# EAGLE design TREMONE (EAGLE 9.2.2)
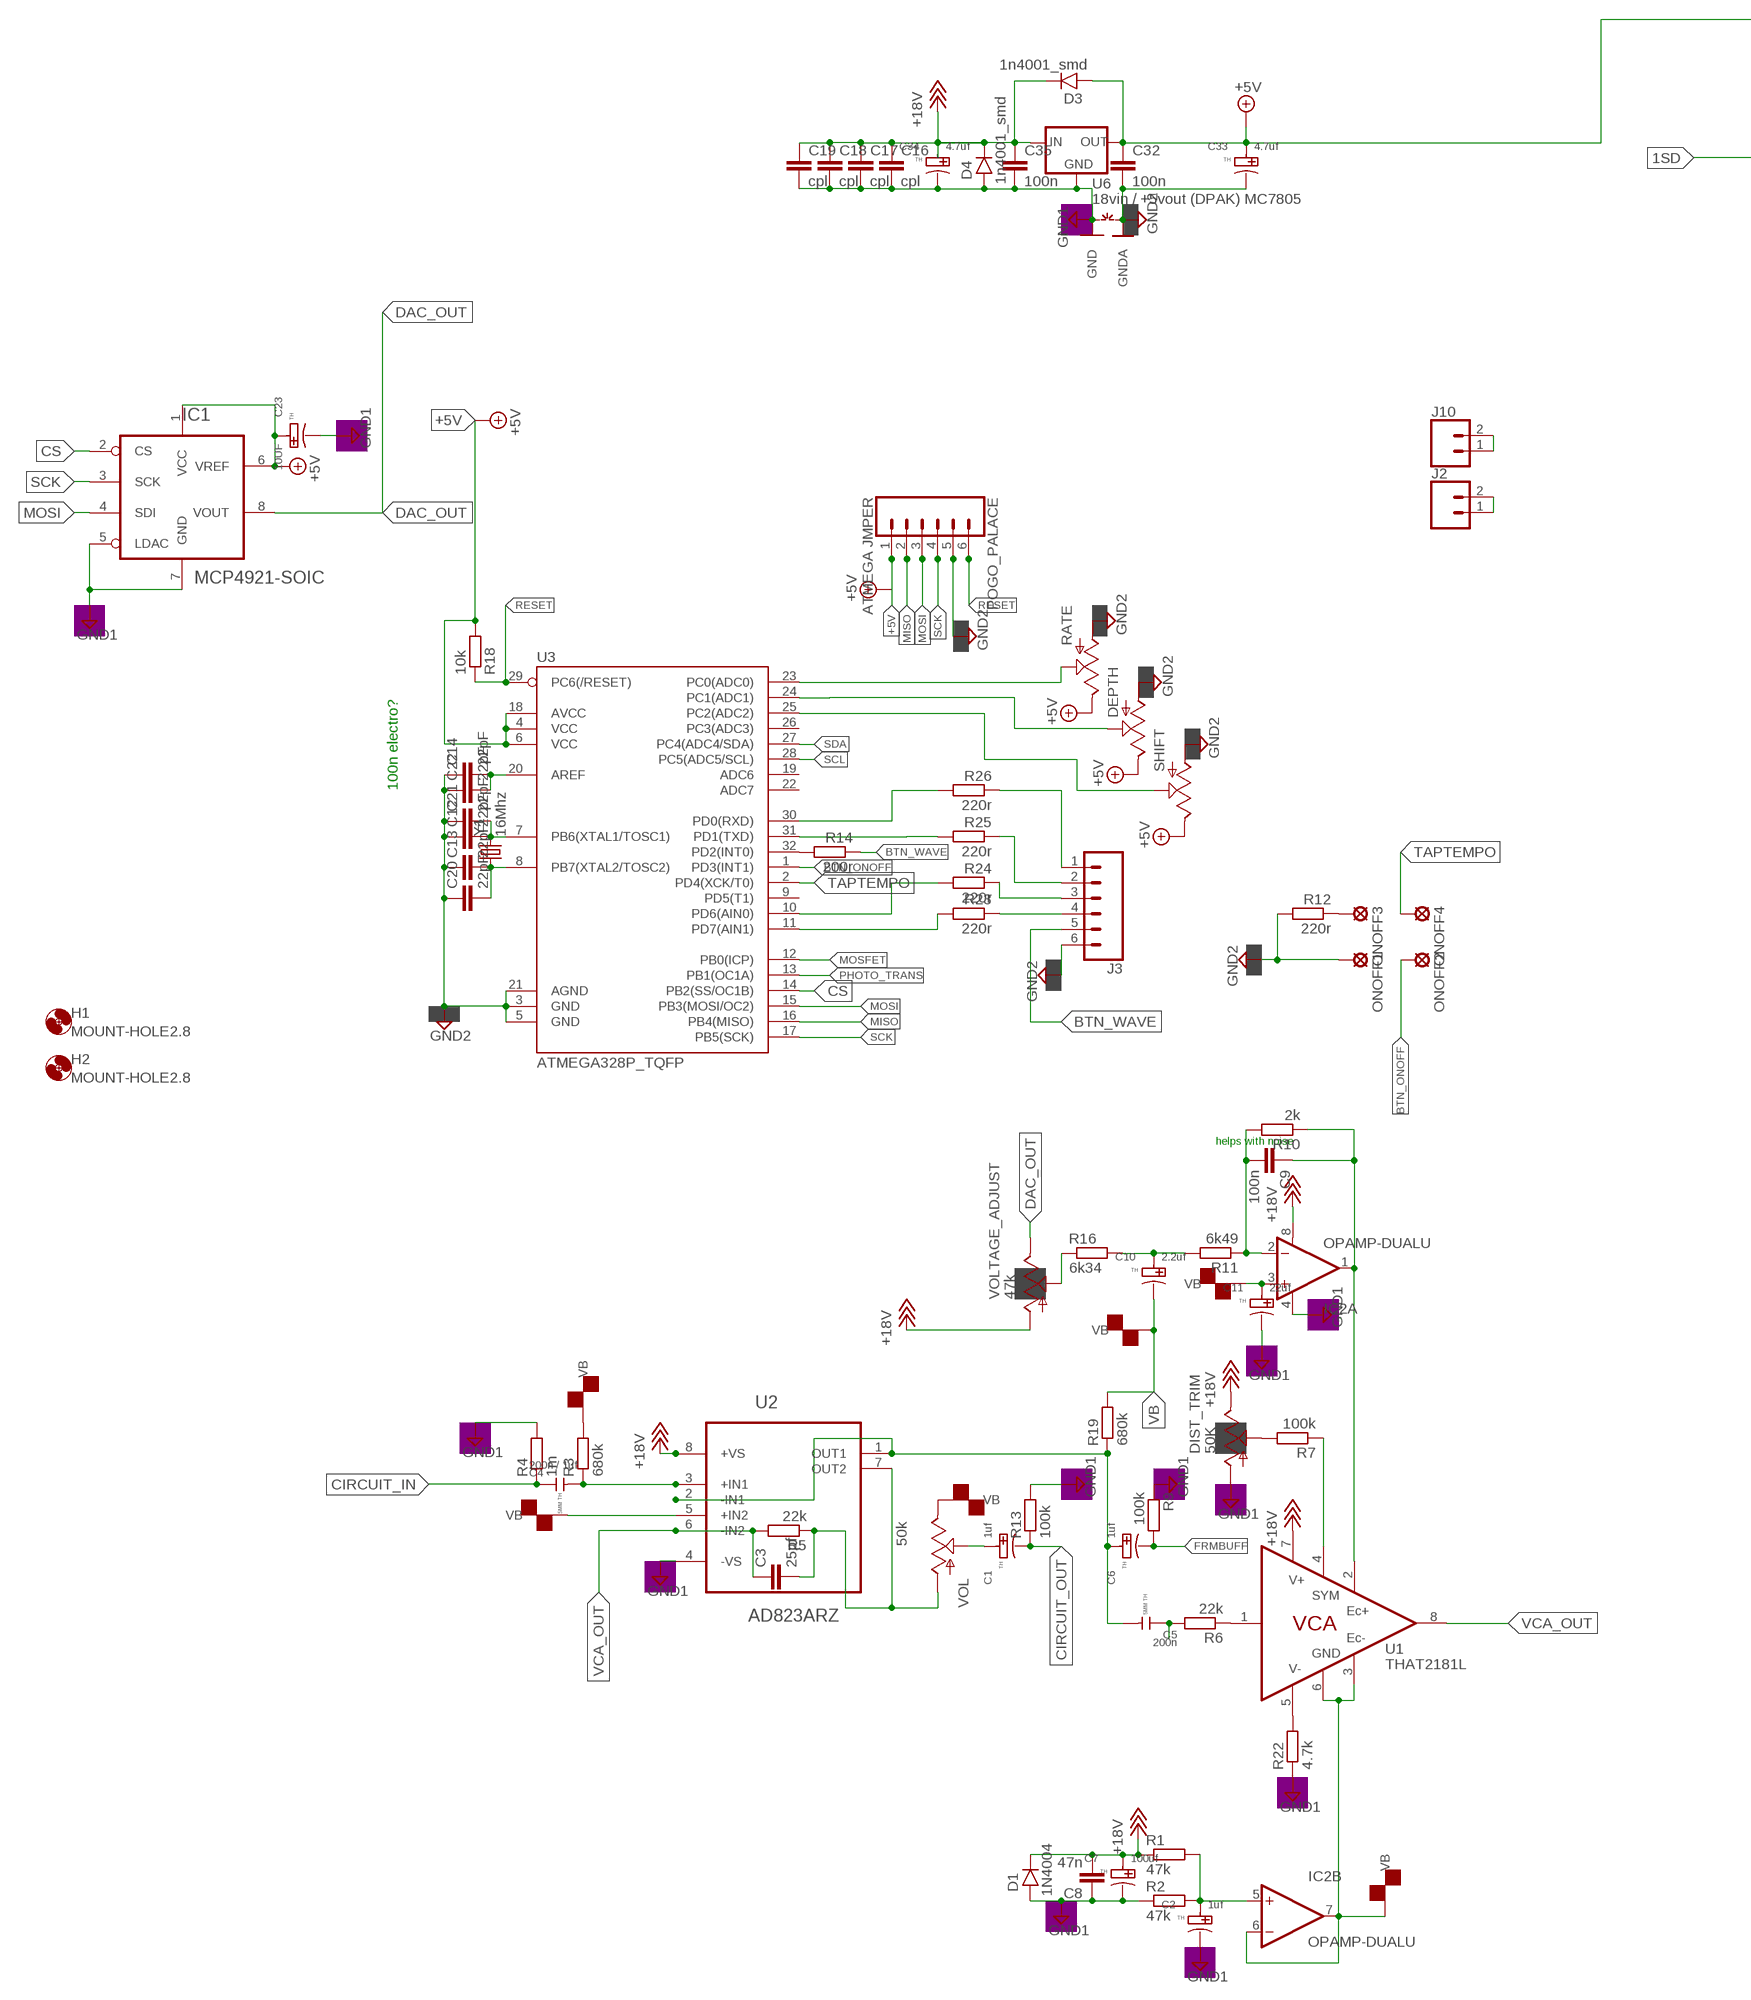
[diagram p0: schematic, sheet 1, part 1 of 2]
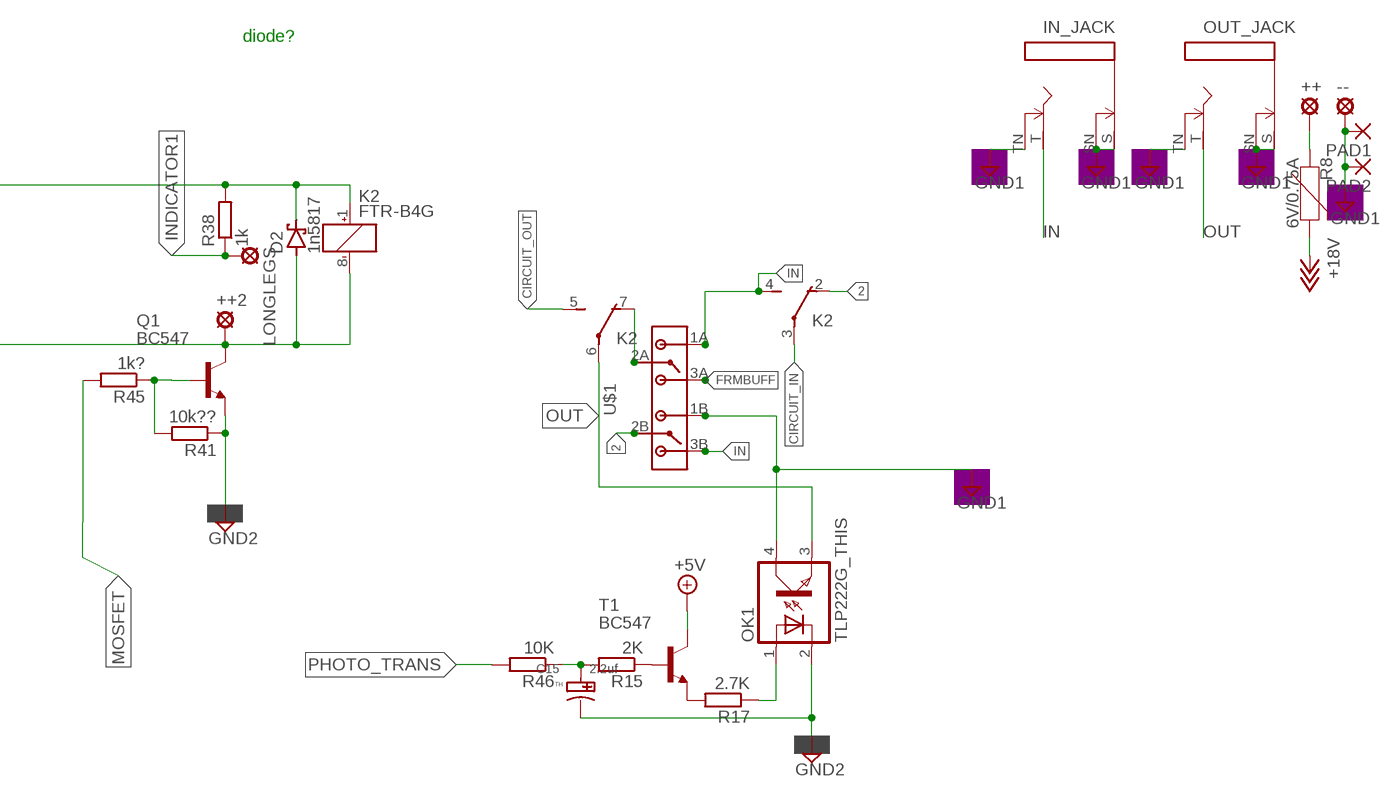
[diagram p1: schematic, sheet 1, part 2 of 2]

## Parts
++  LSP10  [LSP10]
++2  LSP10  [LSP10]
--  LSP10  [LSP10]
C1  1uf  THRU-HOLE-POLARIZED  [PC-D5.3MM]
C2  1uf  THRU-HOLE-POLARIZED  [PC-D5.3MM]
C3  25pf  C-EUC1206  [C1206]
C4  200n / 1uf  THRU_HOLE_5MM_SPACING  [CERAMIC-5MM]
C5  200n  THRU_HOLE_5MM_SPACING  [CERAMIC-5MM]
C6  1uf  THRU-HOLE-POLARIZED  [PC-D5.3MM]
C7  100uf  THRU-HOLE-POLARIZED  [PC-D5.3MM]
C8  47n  C-EUC1206  [C1206]
C9  100n  C-EUC1206  [C1206]
C10  2.2uf  THRU-HOLE-POLARIZED  [PC-D5.3MM]
C11  22uf  THRU-HOLE-POLARIZED  [PC-D5.3MM]
C12  22pF  22PF-0603-50V-5%  [0603]
C13  22pF  22PF-0603-50V-5%  [0603]
C14  22pF  22PF-PTH-2.54MM-200V-5%  [CAP-PTH-2.54]
C15  2.2uf  THRU-HOLE-POLARIZED  [PC-D5.3MM]
C16  cpl  C-EUC1206  [C1206]
C17  cpl  C-EUC1206  [C1206]
C18  cpl  C-EUC1206  [C1206]
C19  cpl  C-EUC1206  [C1206]
C20  22pF  22PF-PTH-2.54MM-200V-5%  [CAP-PTH-2.54]
C21  22pF  22PF-PTH-2.54MM-200V-5%  [CAP-PTH-2.54]
C22  22pF  22PF-0603-50V-5%  [0603]
C23  10UF  THRU-HOLE-POLARIZED  [PC-D5.3MM]
C32  100n  C-EUC1206  [C1206]
C33  4.7uf  THRU-HOLE-POLARIZED  [PC-D5.3MM]
C34  4.7uf  THRU-HOLE-POLARIZED  [PC-D5.3MM]
C35  100n  C-EUC1206  [C1206]
D1  1N4004  1N400X.1  [DO41-1]
D2  1n5817  SCHOTTKY-DIODESMD  [SMB]
D3  1n4001_smd  1N400X.1  [DO41-1]
D4  1n4001_smd  1N400X.1  [DO41-1]
DEPTH  POT  [ALPS_POT]
DIST_TRIM  50K  TRIM_US-3223G  [3223G]
H1  MOUNT-HOLE2.8  [2,8]
H2  MOUNT-HOLE2.8  [2,8]
IC1  MCP4921-SOIC  [SOIC-8]
IC2  OPAMP-DUALU  [SO08]
IN_JACK  MMMONNNNOHOLES  [MONONOHOLES]
J2  CONN_02PTH3  [1X02_LONGPADS]
J3  CONN_06NO_SILK_FEMALE_PTH  [1X06_NO_SILK]
J10  CONN_02PTH3  [1X02_LONGPADS]
K2  FTR-B4G  [FTR-B4G]
LONGLEGS  LSP10  [LSP10]
OK1  TLP222G_THIS  [DIL04]
ONOFF1  LSP10  [LSP10]
ONOFF2  LSP10  [LSP10]
ONOFF3  LSP10  [LSP10]
ONOFF4  LSP10  [LSP10]
OUT_JACK  MMMONNNNOHOLES  [MONONOHOLES]
PAD1  SMD5  [SMD2,54-5,08]
PAD2  SMD5  [SMD2,54-5,08]
POGO_PALACE  ATMEGA JMPER  CONN_06LONGPADS  [1X06_LONGPADS]
Q1  BC547  [TO92]
R1  47k  R-EU_M1206  [M1206]
R2  47k  R-EU_M1206  [M1206]
R3  680k  R-EU_M1206  [M1206]
R4  1m  R-EU_M1206  [M1206]
R5  22k  R-EU_M1206  [M1206]
R6  22k  R-EU_M1206  [M1206]
R7  100k  R-EU_M1206  [M1206]
R8  6V/0.75A  PPTC_THREE-QUARTER-AMP  [1206]
R9  100k  R-EU_M1206  [M1206]
R10  2k  R-EU_M1206  [M1206]
R11  6k49  R-EU_M1206  [M1206]
R12  220r  R-EU_M1206  [M1206]
R13  100k  R-EU_M1206  [M1206]
R14  200r  R-EU_M1206  [M1206]
R15  2K  R-EU_M1206  [M1206]
R16  6k34  R-EU_M1206  [M1206]
R17  2.7K  R-EU_M1206  [M1206]
R18  10k  R-EU_M1206  [M1206]
R19  680k  R-EU_M1206  [M1206]
R22  4.7k  R-EU_M1206  [M1206]
R23  220r  R-EU_M1206  [M1206]
R24  220r  R-EU_M1206  [M1206]
R25  220r  R-EU_M1206  [M1206]
R26  220r  R-EU_M1206  [M1206]
R38  1k  R-EU_M1206  [M1206]
R41  10k??  R-EU_M1206  [M1206]
R45  1k?  R-EU_M1206  [M1206]
R46  10K  R-EU_M1206  [M1206]
RATE  POT  [ALPS_POT]
SHIFT  POT  [ALPS_POT]
T1  BC547  [TO92]
U1  THAT2181L  [SIP8]
U2  AD823ARZ  [SOIC127P600X175-8N]
U3  ATMEGA328P_TQFP  [TQFP32-08]
U6  18vin / +5vout (DPAK) MC7805  V_REG_78XX7812  [TO-252]
U$1  BYSWITCH  [BUFF/TRBYPASS]
VOL  50k  POT  [ALPS_POT]
VOLTAGE_ADJUST  47k  TRIM_US-3223G  [3223G]
Y1  16Mhz  CRYSTALHC49US  [HC49US]
~NUDEV~1  GND-GNDA1,27MM  [GND-GNDA-1,27MM]

## Nets
1SD: ++2.MP D2.A K2.8(K:-) Q1.3(C)
2: K2.2(-1:O) U$1.2B
+5V: C23.+ C32.1 C33.+ D2.C D3.A DEPTH.P$1(E) IC1.1(VCC) IC1.6(VREF) K2.1(K:+) POGO_PALACE.1 R18.2 R38.2 RATE.P$1(E) SHIFT.P$1(E) T1.3(C) U3.4(VCC) U3.6(VCC) U3.18(AVCC) U6.2(OUT)
+18V: C7.+ C8.2 C16.1 C17.1 C18.1 C19.1 C34.+ C35.1 D1.C D3.C D4.C DIST_TRIM.3(E) IC2.8(A:V+) R1.1 R8.2 U1.7(V+) U2.8(+VS) U6.1(IN) VOLTAGE_ADJUST.1(A)
BTN_ONOFF: ONOFF2.MP U3.1(PD3(INT1))
BTN_WAVE: J3.5 R14.1
CIRCUIT_IN: C4.1 K2.3(-1:P) R4.1
CIRCUIT_OUT: C1.- K2.5(-2:S) R13.1
CS: IC1.2(CS) U3.14(PB2(SS/OC1B))
DAC_OUT: IC1.8(VOUT) VOLTAGE_ADJUST.3(E)
FRMBUFF: C6.- R9.2 U$1.3A
GND1: --.MP C2.- C7.- C8.1 C11.- C16.2 C17.2 C18.2 C19.2 C23.- C34.- C35.2 D1.A D4.A DIST_TRIM.1(A) IC1.5(LDAC) IC1.7(GND) IC2.4(A:V-) IN_JACK.S IN_JACK.SN IN_JACK.TN OK1.4(COL) OUT_JACK.S OUT_JACK.SN OUT_JACK.TN PAD1.1(P) PAD2.1(P) R2.1 R4.2 R9.1 R13.2 R22.1 U2.4(-VS) U6.3(GND) U$1.1B ~NUDEV~1.GND
GND2: C12.1 C13.1 C14.1 C15.- C20.1 C21.1 C22.1 C32.2 C33.- DEPTH.P$3(A) J3.6 OK1.2(C) ONOFF1.MP POGO_PALACE.5 Q1.1(E) R12.2 R41.1 RATE.P$3(A) SHIFT.P$3(A) U3.3(GND) U3.5(GND) U3.21(AGND) ~NUDEV~1.GNDA
IN: IN_JACK.T K2.4(-1:S) U$1.1A U$1.3B
INDICATOR1: LONGLEGS.MP R38.1
MISO: POGO_PALACE.2 U3.16(PB4(MISO))
MOSFET: R45.2 U3.12(PB0(ICP))
MOSI: IC1.4(SDI) POGO_PALACE.3 U3.15(PB3(MOSI/OC2))
N$1: C4.2 R3.1 U2.3(+IN1)
N$2: C2.+ IC2.5(B:+IN) R1.2 R2.2
N$3: ONOFF3.MP R12.1
N$4: R16.1 VOLTAGE_ADJUST.2(S)
N$5: C3.2 R5.1 U2.7(OUT2) VOL.P$3(A)
N$6: C5.2 C6.+ R19.1 U2.1(OUT1) U2.2(-IN1)
N$7: C5.1 R6.2
N$8: R6.1 U1.1(IN)
N$9: C1.+ VOL.P$2(S)
N$10: J2.1 J2.2
N$11: R7.1 U1.4(SYM)
N$12: DIST_TRIM.2(S) R7.2
N$13: C13.2 C20.2 U3.8(PB7(XTAL2/TOSC2)) Y1.1
N$14: C9.2 IC2.2(A:-IN) R10.2 R11.1
N$15: C12.2 C21.2 U3.7(PB6(XTAL1/TOSC1)) Y1.2
N$16: C14.2 C22.2 U3.20(AREF)
N$17: J3.4 R23.1
N$18: J3.3 R24.1
N$19: J3.2 R25.1
N$20: J10.1 J10.2
N$21: R22.2 U1.5(V-)
N$22: J3.1 R26.1
N$23: R26.2 U3.30(PD0(RXD))
N$24: R25.2 U3.31(PD1(TXD))
N$25: R24.2 U3.10(PD6(AIN0))
N$26: R23.2 U3.11(PD7(AIN1))
N$27: RATE.P$2(S) U3.23(PC0(ADC0))
N$28: DEPTH.P$2(S) U3.24(PC1(ADC1))
N$29: SHIFT.P$2(S) U3.25(PC2(ADC2))
N$30: R14.2 U3.32(PD2(INT0))
N$39: C15.+ R15.2 R46.1
N$40: R15.1 T1.2(B)
N$41: ++.MP R8.1
N$42: C9.1 IC2.1(A:OUT) R10.1 U1.2(EC+)
N$43: R17.2 T1.1(E)
N$44: OK1.1(A) R17.1
N$59: K2.7(-2:O) U$1.2A
N$84: Q1.2(B) R41.2 R45.1
OUT: K2.6(-2:P) OK1.3(EMIT) OUT_JACK.T
PHOTO_TRANS: R46.2 U3.13(PB1(OC1A))
R: C10.+ R11.2 R16.2
RESET: POGO_PALACE.6 R18.1 U3.29(PC6(/RESET))
SCK: IC1.3(SCK) POGO_PALACE.4 U3.17(PB5(SCK))
SCL: U3.28(PC5(ADC5/SCL))
SDA: U3.27(PC4(ADC4/SDA))
TAPTEMPO: ONOFF4.MP U3.2(PD4(XCK/T0))
VB: C10.- C11.+ IC2.3(A:+IN) IC2.6(B:-IN) IC2.7(B:OUT) R3.2 R19.2 U1.3(EC-) U1.6(GND) U2.5(+IN2) VOL.P$1(E)
VCA_OUT: C3.1 R5.2 U1.8(OUT) U2.6(-IN2)
Unconnected: U3.9(PD5(T1)) U3.19(ADC6) U3.22(ADC7) U3.26(PC3(ADC3))

## Notes on the sheet
- diode?
- 100n electro?
- helps with noise

## Library data of the parts
++ ++2 -- LONGLEGS ONOFF1-ONOFF4 = solpad:LSP10: SOLDER PAD drill 1.0 mm, distributor Buerklin, 12H555
C1 C2 C6 C7 C10 C11 C15 C23 C33 C34 = GT_Capacitor:THRU-HOLE-POLARIZED: 302030033; PACKAGE: TH
C3 C8 C9 C16-C19 C32 C35 = resistor:C-EU: CAPACITOR, European symbol
C4 C5 = GT_Capacitor:THRU_HOLE_5MM_SPACING: 302010202; PACKAGE: 5MM TH
C12 C13 C22 = SparkFun-Capacitors:22PF: 22pF ceramic capacitors A capacitor is a passive two-terminal electrical component used to store electrical energy temporarily in an electric field.; PROD_ID: CAP-07876
C14 C20 C21 = SparkFun-Capacitors:22PF: 22pF ceramic capacitors A capacitor is a passive two-terminal electrical component used to store electrical energy temporarily in an electric field.; PROD_ID: CAP-09128
D1 D3 D4 = gm-diodes:1N400X: Rectifier Diodes often used in power supply to prevent damage from reverse polarization
D2 = diode:SCHOTTKY-DIODE: Schottky Diode
DEPTH RATE SHIFT VOL = SparkFun-Electromechanical:POT
DIST_TRIM VOLTAGE_ADJUST = pot:TRIM_US-: POTENTIOMETER
H1 H2 = holes:MOUNT-HOLE: MOUNTING HOLE with drill center marker
IC1 = dac:MCP49*1: Digital-to-Analog Converter
IC2 = SparkFun-AnalogIC:OPAMP-DUAL: Generic op-amp footprint
IN_JACK OUT_JACK = gm-jacks2:MMMONNN
J2 J10 = GT_Connectors:CONN_02: Multi connection point. Often used as Generic Header-pin footprint for 0.1 inch spaced/style header connections On any of the 0.1 inch spaced packages, you can populate with these: Break Away Headers - Straight <https://www.sparkfun.com/products/116> (PRT-00116) Break Away Male Headers - Right Angle <https://www.sparkfun.com/products/553> (PRT-00553) Female Headers <https://www.sparkfun.com/products/115> (PRT-00115) Break Away Headers - Machine Pin <https://www.sparkfun.com/products/117> (PRT-00117) Break Away Female Headers - Swiss Machine Pin <https://www.sparkfun.com/products/743> (PRT-00743) For SCREWTERMINALS and SPRING TERMINALS visit here: Screw Terimnals on SparkFun.com <https://www.sparkfun.com/search/results?term=Screw+Terminals> (5mm/3.5mm/2.54mm spacing) This device is also useful as a general connection point to wire up your design to another part of your project. Our various solder wires solder well into these plated through hole pads. Hook-Up Wire - Assortment (Stranded, 22 AWG) <https://www.sparkfun.com/products/11375> (PRT-11375) Hook-Up Wire - Assortment (Solid Core, 22 AWG) <https://www.sparkfun.com/products/11367> (PRT-11367) View the entire wire category on our website here <https://www.sparkfun.com/categories/141> Special notes: Molex polarized connector foot print use with: PRT-08233 with associated crimp pins and housings. 2.54_SCREWTERM for use with PRT-10571. 3.5mm Screw Terminal footprints for PRT-08084 5mm Screw Terminal footprints for use with PRT-08432
J3 = GT_Connectors:CONN_06: Multi connection point. Often used as Generic Header-pin footprint for 0.1 inch spaced/style header connections On any of the 0.1 inch spaced packages, you can populate with these: Break Away Headers - Straight <https://www.sparkfun.com/products/116> (PRT-00116) Break Away Male Headers - Right Angle <https://www.sparkfun.com/products/553> (PRT-00553) Female Headers <https://www.sparkfun.com/products/115> (PRT-00115) Break Away Headers - Machine Pin <https://www.sparkfun.com/products/117> (PRT-00117) Break Away Female Headers - Swiss Machine Pin <https://www.sparkfun.com/products/743> (PRT-00743) Arduino Stackable Header - 6 Pin <https://www.sparkfun.com/products/9280> (PRT-09280) For SCREWTERMINALS and SPRING TERMINALS visit here: Screw Terimnals on SparkFun.com <https://www.sparkfun.com/search/results?term=Screw+Terminals> (5mm/3.5mm/2.54mm spacing) This device is also useful as a general connection point to wire up your design to another part of your project. Our various solder wires solder well into these plated through hole pads. Hook-Up Wire - Assortment (Stranded, 22 AWG) <https://www.sparkfun.com/products/11375> (PRT-11375) Hook-Up Wire - Assortment (Solid Core, 22 AWG) <https://www.sparkfun.com/products/11367> (PRT-11367) View the entire wire category on our website here <https://www.sparkfun.com/categories/141>; PROD_ID: CONN-08437
K2 = relay:FTR-B4: ULTRA MINIATURE RELAY 2 POLES - 2 A (Slim Profile Signal Relay) FUJITSU FTR-B4 SERIES Source: FTR-B4.pdf
OK1 = GT_optocoupler:TLP222G_THIS: SIEMENS OPTO COUPLER; OC_FARNELL: unknown; OC_NEWARK: unknown
PAD1 PAD2 = wirepad:SMD5: SMD PAD
POGO_PALACE = GT_Connectors:CONN_06: Multi connection point. Often used as Generic Header-pin footprint for 0.1 inch spaced/style header connections On any of the 0.1 inch spaced packages, you can populate with these: Break Away Headers - Straight <https://www.sparkfun.com/products/116> (PRT-00116) Break Away Male Headers - Right Angle <https://www.sparkfun.com/products/553> (PRT-00553) Female Headers <https://www.sparkfun.com/products/115> (PRT-00115) Break Away Headers - Machine Pin <https://www.sparkfun.com/products/117> (PRT-00117) Break Away Female Headers - Swiss Machine Pin <https://www.sparkfun.com/products/743> (PRT-00743) Arduino Stackable Header - 6 Pin <https://www.sparkfun.com/products/9280> (PRT-09280) For SCREWTERMINALS and SPRING TERMINALS visit here: Screw Terimnals on SparkFun.com <https://www.sparkfun.com/search/results?term=Screw+Terminals> (5mm/3.5mm/2.54mm spacing) This device is also useful as a general connection point to wire up your design to another part of your project. Our various solder wires solder well into these plated through hole pads. Hook-Up Wire - Assortment (Stranded, 22 AWG) <https://www.sparkfun.com/products/11375> (PRT-11375) Hook-Up Wire - Assortment (Solid Core, 22 AWG) <https://www.sparkfun.com/products/11367> (PRT-11367) View the entire wire category on our website here <https://www.sparkfun.com/categories/141>
Q1 = transistor-npn:BC547*: NPN Transistor
R1-R7 R9-R19 R22-R26 R38 R41 R45 R46 = resistor:R-EU_: RESISTOR, European symbol
R8 = GOLDTOOTH-Fuses:PPTC: Resettable Fuse PPTC Resettable Fuse. Really a sort of resistor with a polymeric positive temperature coefficient whose resistance increases dramatically with an increase in temperature. When heated by the power passing through the resistance rises causing the current to be limited, protecting the circuit. This is achieved by the transition of the polymer from a crystalline to an amorphous state where the conductive carbon separates breaking the conductive pathways found in the cool crystalline structure. When a PPTC cools back down it resumes conducting letting the circuit turn back on. SparkFun Products: SparkFun RedBoard - Programmed with Arduino <https://www.sparkfun.com/products/12757> Pro Micro - 5V/16MHz <https://www.sparkfun.com/products/12640> Arduino Pro 328 - 5V/16MHz <https://www.sparkfun.com/products/10915> MP3 Trigger <https://www.sparkfun.com/products/13720>; PROD_ID: RES-11150
T1 = transistor:BC547: NPN TRANSISTOR
U1 = that-corp:THAT2181: VCA Trimmable IC
U2 = Analog Devices_By_element14_Batch_1:AD823ARZ: Dual, 16 MHz, Rail-to-Rail FET Input Amplifier; MPN: AD823ARZ; OC_FARNELL: 1311009; OC_NEWARK: 12M9057; PACKAGE: SOIC-8; SUPPLIER: ANALOG DEVICES
U3 = SparkFun-IC-Microcontroller:ATMEGA328P_TQFP: Popular 328P in QFP Storefront component: ATmega328 - TQFP <https://www.sparkfun.com/products/13448> (COM-13448) Datasheet <http://www.sparkfun.com/datasheets/Components/SMD/ATMega328.pdf> SparkFun Products SparkFun RedBoard - Programmed with Arduino <https://www.sparkfun.com/products/12757> (DEV-12757) Arduino Pro Mini 328 - 5V/16MHz <https://www.sparkfun.com/products/11113> (DEV-11113) Arduino Pro Mini 328 - 3.3V/8MHz <https://www.sparkfun.com/products/11114> (DEV-11114) SparkFun OpenLog <https://www.sparkfun.com/products/13712> (DEV-13712) SparkFun MicroView - OLED Arduino Module <https://www.sparkfun.com/products/12923> (DEV-12923) SparkFun Digital Sandbox <https://www.sparkfun.com/products/12651> (DEV-12651) SparkFun PicoBoard <https://www.sparkfun.com/products/11888> (WIG-11888) Arduino Fio <https://www.sparkfun.com/products/10116> (DEV-10116) LilyPad Arduino 328 Main Board <https://www.sparkfun.com/products/13342> (DEV-13342) SparkFun RedStick <https://www.sparkfun.com/products/13741> (DEV-13741) LilyPad MP3 <https://www.sparkfun.com/products/11013> (DEV-11013) LilyPad Arduino SimpleSnap <https://www.sparkfun.com/products/10941> (DEV-10941) SparkFun Stepoko <https://www.sparkfun.com/products/13899> (ROB-13899) SparkFun Geiger Counter <https://www.sparkfun.com/products/11345> (SEN-11345) SparkFun EL Sequencer <https://www.sparkfun.com/products/12781> (COM-12781) Arduino Pro 328 - 5V/16MHz <https://www.sparkfun.com/products/10915> (DEV-10915) CryptoCape <https://www.sparkfun.com/products/12773> (DEV-12773) SparkFun IR Thermometer Evaluation Board - MLX90614 <https://www.sparkfun.com/products/10740> (SEN-10740) SparkFun RedBot Mainboard <https://www.sparkfun.com/products/12097> (ROB-12097) Arduino Pro 328 - 3.3V/8MHz <https://www.sparkfun.com/products/10914> (DEV-10914) SparkFun Block for Intel® Edison - Arduino <https://www.sparkfun.com/products/13036> (DEV-13036) SparkFun Simon Says - Surface Mount Soldering Kit <https://www.sparkfun.com/products/10935> (KIT-10935) SparkFun 7-Segment Serial Display - Red <https://www.sparkfun.com/products/11441> (COM-11441) SparkFun 7-Segment Serial Display - White <https://www.sparkfun.com/products/11629> (COM-11629) SparkFun 7-Segment Serial Display - Yellow <https://www.sparkfun.com/products/11443> (COM-11443) SparkFun 7-Segment Serial Display - Kelly Green <https://www.sparkfun.com/products/11440> (COM-11440) SparkFun 7-Segment Serial Display - Blue <https://www.sparkfun.com/products/11442> (COM-11442) SparkFun OpenSegment Serial Display - 20mm (Blue) <https://www.sparkfun.com/products/11647> (COM-11647) SparkFun OpenSegment Serial Display - 20mm (Green) <https://www.sparkfun.com/products/11646> (COM-11646) SparkFun OpenSegment Serial Display - 20mm (White) <https://www.sparkfun.com/products/11648> (COM-11648) SparkFun OpenSegment Serial Display - 20mm (Red) <https://www.sparkfun.com/products/11644> (COM-11644) SparkFun OpenSegment Serial Display - 20mm (Yellow) <https://www.sparkfun.com/products/11645> (COM-11645) SparkFun OpenSegment Shield <https://www.sparkfun.com/products/13190> (DEV-13190); PROD_ID: IC-09069
U6 = SparkFun-IC-Power:V_REG_78XX: Voltage Regulator Standard 78xx regulator. IGO (Input Ground Output). Spark Fun Electronics SKU : COM-00107; PROD_ID: VREG-12370; VALUE: +12v
U$1 = switch-dil:BYSWITCH
Y1 = SparkFun-FreqCtrl:CRYSTAL: Various standard crystals. Proven footprints. Spark Fun Electronics SKU : COM-00534
~NUDEV~1 = ground-junctions:GND-GNDA: Connect GND - GNDA without DRC-Error, display layer 53 (54) to make copper (ROUTE) from GND to GNDA Select also layer 53 (54) in CAM-Job!

## Board
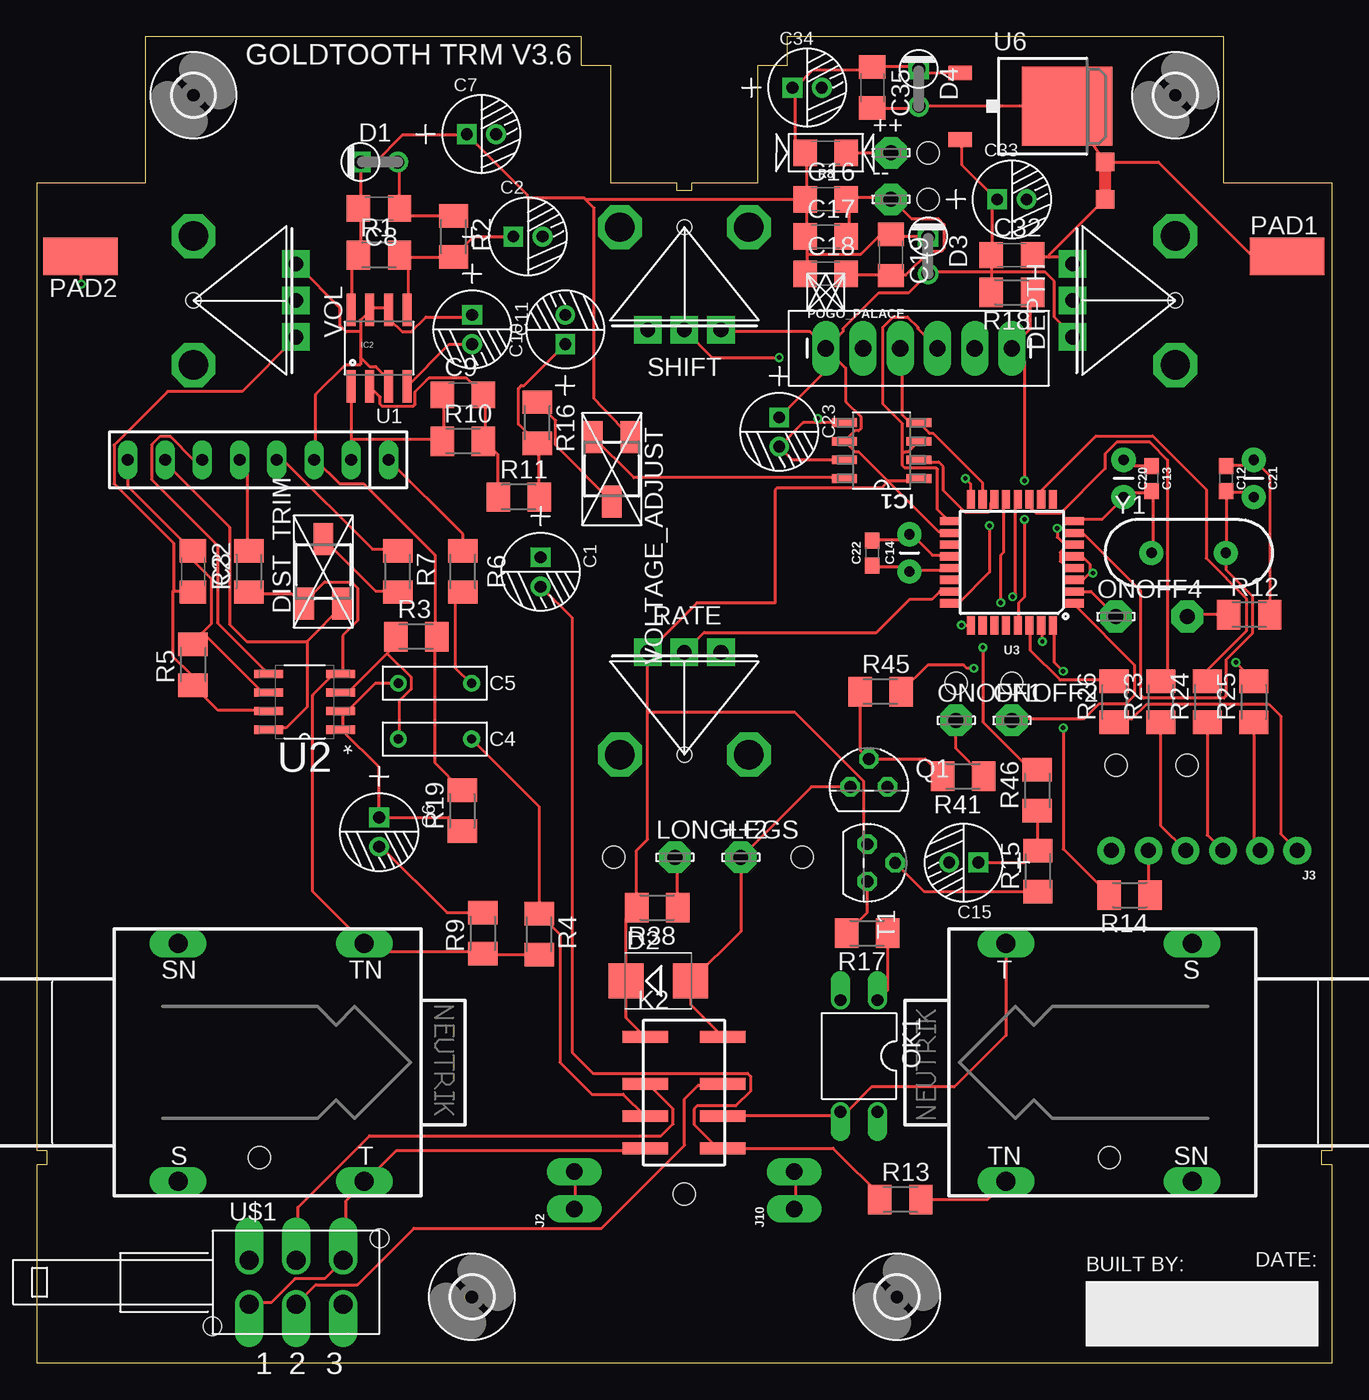
[diagram p2: board, top side]
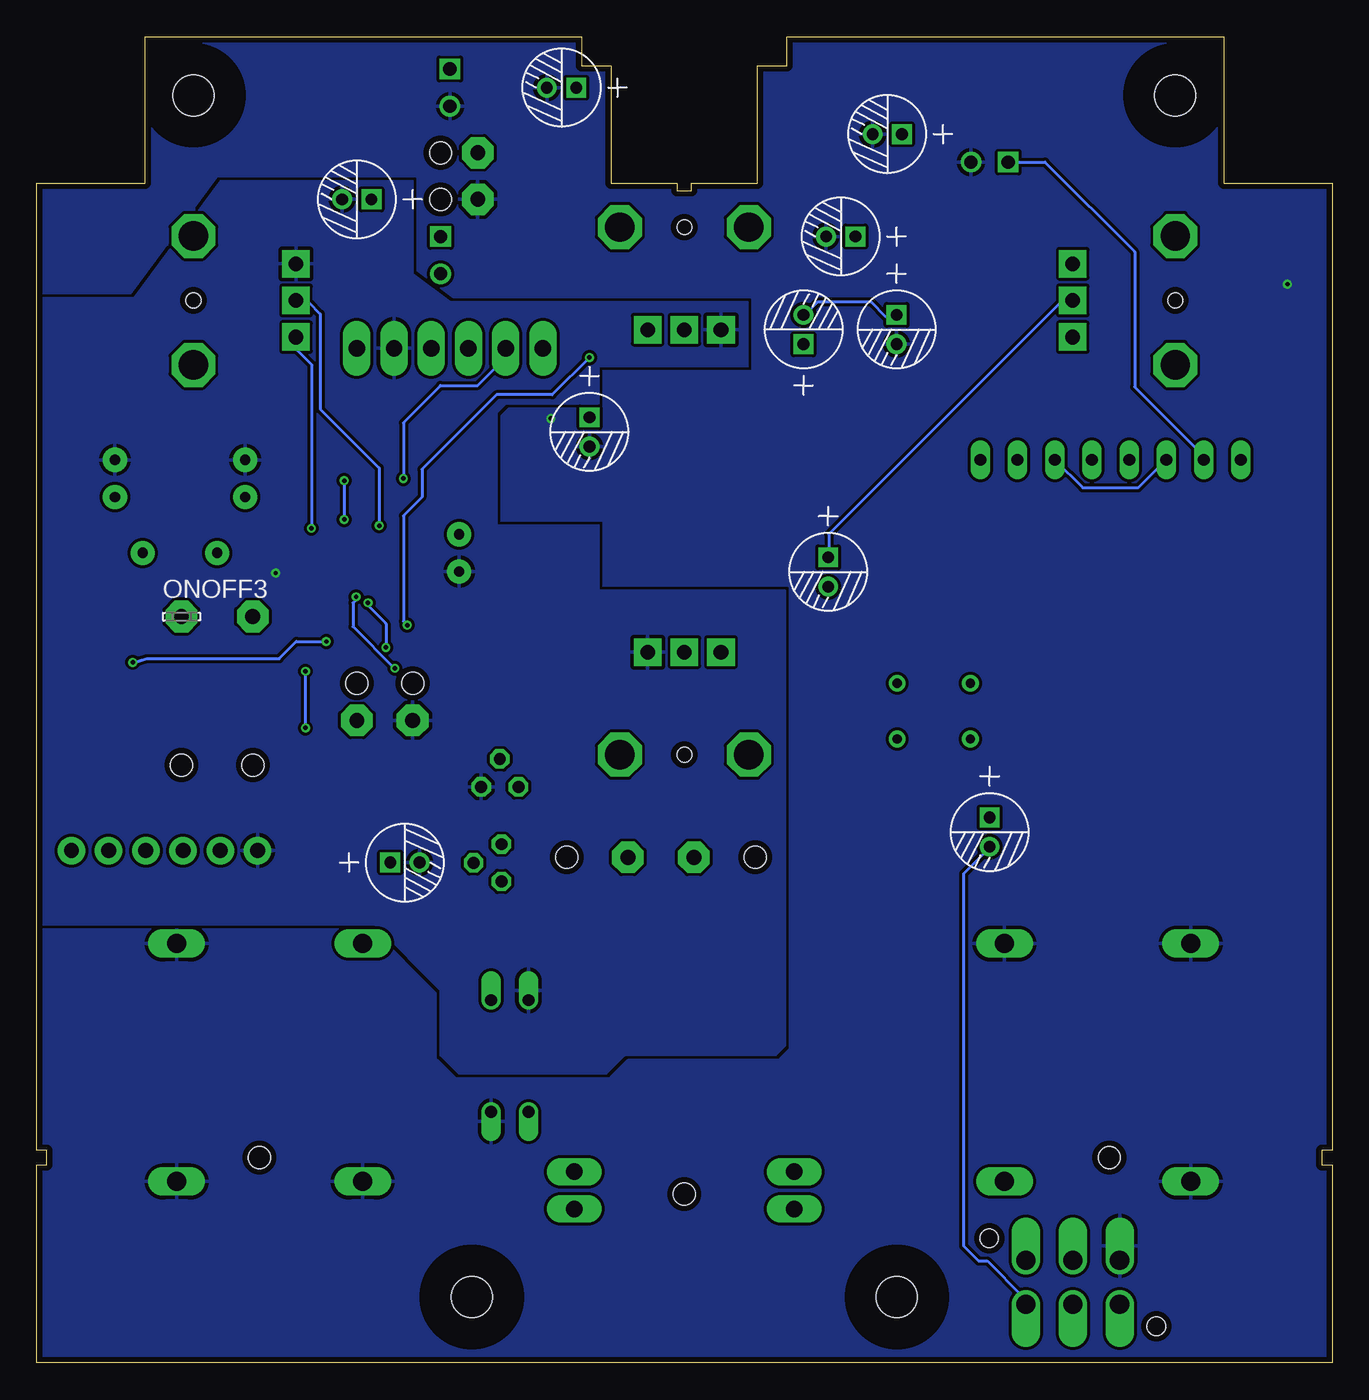
[diagram p3: board, bottom side, seen from below]

Size 88.4 x 90.5 mm. Coordinates in mm from the lower left corner, seen from the top.
Outline: 88.4,80.5 81,80.5 81,90.5 51.2,90.5 51.2,88.5 49.2,88.5 49.2,80.5 44.7,80.5 44.7,80 43.7,80 43.7,80.5 39.2,80.5 39.2,88.5 37.2,88.5 37.2,90.5 7.4,90.5 7.4,80.5 0,80.5 0,14.5 0.7,14.5 0.7,13.5 0,13.5 0,0 88.4,0 88.4,13.5 87.7,13.5 87.7,14.5 88.4,14.5 88.4,80.5
Copper layers (1*16): Top 0.035mm / dielectric 1.5mm / Bottom 0.035mm
Design rules "GT": minimum track width 8mil, minimum drill 0.3mm, track to track 8mil, track to pad 6mil, pad to pad 6mil, via to via 6mil, smd to smd 0mil, copper to edge 0.4mm, drill to drill 10mil, minimum pad ring 10mil, minimum via ring 6mil, stop-mask expansion 2mil, vias tented up to drill 25mil, thermal gap 10mil

### Footprints (pad centres in the part's own frame; a part is rotated, then mirrored left to right if it is on the bottom)
LSP10 = drill 1.016 pad 2.159 octagon: MP 0,0
PC-D5.3MM = drill 0.8 pad 1.35 square: + -1,0 | drill 0.8 pad 1.35: - 1,0
C1206 = smd 1.6 x 1.8: 1 -1.4,0; 2 1.4,0
CERAMIC-5MM = drill 0.635 pad 1.143: 1 -2.5,0; 2 2.5,0
0603 = smd 1.1 x 1: 1 -0.85,0; 2 0.85,0
CAP-PTH-2.54 = drill 0.7 pad 1.651: 1 -1.27,0; 2 1.27,0
DO41-1 = drill 0.9: A 1.27,0 | drill 0.9 square: C -1.27,0
SMB = smd 2.4 x 2.4: A 2.2,0; C -2.2,0
ALPS_POT = drill 1 pad 1.88 square: P$1 7,-2.5; P$2 7,0; P$3 7,2.5 | drill 2 octagon: P$4 0,-4.4; P$5 0,4.4 | hole 1: 0,0
3223G = smd 2.184 x 1.321: 1 -2.2,1.273; 2 2.2,0; 3 -2.2,-1.273
2,8 = hole 2.8: 0,0
SOIC-8 = smd 1.72 x 0.6: 1 -2.54,1.905; 2 -2.54,0.635; 3 -2.54,-0.635; 4 -2.54,-1.905; 5 2.54,-1.905; 6 2.54,-0.635; 7 2.54,0.635; 8 2.54,1.905
SO08 = smd 0.61 x 2.21: 1 -1.905,-2.616; 2 -0.635,-2.616; 3 0.635,-2.616; 4 1.905,-2.616; 5 1.905,2.616; 6 0.635,2.616; 7 -0.635,2.616; 8 -1.905,2.616
MONONOHOLES = drill 1.3 long: S 6.35,8.115; SN 6.35,-8.115; T -6.35,8.115; TN -6.35,-8.115
1X02_LONGPADS = drill 1.118 pad 1.88 long: 1 0,0; 2 2.54,0
1X06_NO_SILK = drill 1.016 pad 1.88: 1 0,0; 2 2.54,0; 3 5.08,0; 4 7.62,0; 5 10.16,0; 6 12.7,0
FTR-B4G = smd 0.8 x 3.1: 1 -3.8,-2.65; 2 -0.6,-2.65; 3 1.6,-2.65; 4 3.8,-2.65; 5 3.8,2.65; 6 1.6,2.65; 7 -0.6,2.65; 8 -3.8,2.65
DIL04 = drill 0.813 offset: 1 -1.27,-3.81; 2 1.27,-3.81; 3 1.27,3.81; 4 -1.27,3.81
SMD2,54-5,08 = smd 2.54 x 5.08: 1 0,0
1X06_LONGPADS = drill 1.118 pad 1.88 long: 1 0,0; 2 2.54,0; 3 5.08,0; 4 7.62,0; 5 10.16,0; 6 12.7,0
TO92 = drill 0.813 octagon: 1 1.27,0; 2 0,1.905; 3 -1.27,0
M1206 = smd 1.6 x 2: 1 -1.4,0; 2 1.4,0
1206 = smd 1.6 x 1.8: 1 -1.4,0; 2 1.4,0
SIP8 = drill 0.813 long: 1 -10.16,0; 2 -7.62,0; 3 -5.08,0; 4 -2.54,0; 5 0,0; 6 2.54,0; 7 5.08,0; 8 7.62,0
SOIC127P600X175-8N = smd 1.981 x 0.559: 1 -2.464,1.905; 2 -2.464,0.635; 3 -2.464,-0.635; 4 -2.464,-1.905; 5 2.464,-1.905; 6 2.464,-0.635; 7 2.464,0.635; 8 2.464,1.905
TQFP32-08 = smd 1.27 x 0.559: 1 -4.293,2.8; 2 -4.293,2; 3 -4.293,1.2; 4 -4.293,0.4; 5 -4.293,-0.4; 6 -4.293,-1.2; 7 -4.293,-2; 8 -4.293,-2.8; 17 4.293,-2.8; 18 4.293,-2; 19 4.293,-1.2; 20 4.293,-0.4; 21 4.293,0.4; 22 4.293,1.2; 23 4.293,2; 24 4.293,2.8 | smd 0.559 x 1.27: 9 -2.8,-4.293; 10 -2,-4.293; 11 -1.2,-4.293; 12 -0.4,-4.293; 13 0.4,-4.293; 14 1.2,-4.293; 15 2,-4.293; 16 2.8,-4.293; 25 2.8,4.293; 26 2,4.293; 27 1.2,4.293; 28 0.4,4.293; 29 -0.4,4.293; 30 -1.2,4.293; 31 -2,4.293; 32 -2.8,4.293
TO-252 = smd 1 x 1.6: 1 -2.28,-4.8; 2 2.28,-4.8 | smd 5.4 x 6.2: 3 0,2.5
BUFF/TRBYPASS = drill 1.3 offset: 1A -3.2,-1.5; 1B -3.2,1.5; 2A 0,-1.5; 2B 0,1.5; 3A 3.2,-1.5; 3B 3.2,1.5 | hole 1.25: -5.7,-3; 5.7,3
HOLD = hole 1.5: 0,0
HC49US = drill 0.7 pad 1.651: 1 -2.54,0; 2 2.54,0
GND-GNDA-1,27MM = smd 1.27 x 1.27: GND -1.27,0; GNDA 1.27,0

### Placement (x,y rotation side)
++  58.3,82.58 0 top
++2  48.05,34.5 0 top
--  58.3,79.4 0 top
C1  34.39,53.97 270 top
C2  33.53,76.86 0 top
C3  10.67,54 270 top
C4  27.18,42.57 180 top
C5  27.18,46.38 180 top
C6  23.37,36.22 270 top
C7  30.36,83.84 0 top
C8  23.37,78.77 180 top
C9  29.09,66.06 0 top
C10  36.07,70.51 90 top
C11  29.72,70.51 270 top
C12  81.16,60.35 270 top
C13  76.08,60.35 270 top
C14  59.56,55.27 90 top
C15  63.27,34.14 180 top
C16  53.85,79.4 0 top
C17  53.85,76.86 0 top
C18  53.85,74.32 0 top
C19  58.3,75.59 270 top
C20  74.17,60.35 270 top
C21  83.06,60.35 270 top
C22  57.02,55.27 90 top
C23  50.67,63.53 270 top
C32  66.55,75.59 0 top
C33  66.55,79.4 0 top
C34  52.58,87.02 0 top
C35  57.02,87.02 270 top
D1  23.37,81.94 0 top
D2  42.42,26.06 0 top
D3  60.84,75.59 270 top
D4  60.2,87.02 270 top
DEPTH  77.7,72.5 0 bottom
DIST_TRIM  19.56,54 90 top
H1  10.7,86.5 0 top
H2  77.7,86.5 0 top
H3  MOUNT-HOLE2.8  [2,8]  29.7,4.5 0 top
H4  MOUNT-HOLE2.8  [2,8]  58.7,4.5 0 top
IC1  57.66,62.25 180 top
IC2  23.37,69.24 0 top
IN_JACK  16,20.5 180 top
J2  36.7,10.5 90 top
J3  86.03,34.96 180 top
J10  51.7,10.5 90 top
K2  44.18,18.44 270 top
LONGLEGS  43.55,34.5 0 top
OK1  56.12,20.94 180 top
ONOFF1  62.74,43.84 0 top
ONOFF2  66.55,43.84 0 top
ONOFF3  78.52,50.93 0 bottom
ONOFF4  73.65,50.93 0 top
OUT_JACK  72.5,20.5 0 top
PAD1  85.31,75.5 270 top
PAD2  2.99,75.5 90 top
POGO_PALACE  53.85,69.24 0 top
Q1  56.79,39.31 0 top
R1  23.37,75.59 0 top
R2  28.45,76.86 270 top
R3  25.91,49.55 0 top
R4  34.29,29.25 270 top
R5  10.67,47.65 90 top
R6  29.09,54 270 top
R7  24.64,54 270 top
R8  53.85,82.58 180 top
R9  30.44,29.32 90 top
R10  29.09,62.89 0 top
R11  32.9,59.08 0 top
R12  82.75,51.06 0 top
R13  58.94,11.14 0 top
R14  74.59,31.92 180 top
R15  68.32,33.56 90 top
R16  34.16,64.16 270 top
R17  56.67,29.32 180 top
R18  66.55,73.05 180 top
R19  29.05,37.67 90 top
R22  14.48,54 90 top
R23  76.71,45.11 90 top
R24  79.89,45.11 90 top
R25  83.06,45.11 90 top
R26  73.53,45.11 90 top
R38  42.35,31.07 180 top
R41  63.22,40.03 180 top
R45  57.59,45.8 0 top
R46  68.28,39.07 90 top
RATE  44.2,41.5 90 bottom
SHIFT  44.2,77.5 270 bottom
T1  56.68,34.12 270 top
U1  13.85,61.62 180 top
U2  18.29,45.11 180 top
U3  66.55,54.64 180 top
U6  67.82,85.75 270 top
U$1  17.7,5.5 0 top
U$2  [HOLD]  60.84,79.4 0 top
U$3  [HOLD]  60.84,82.58 0 top
U$5  [HOLD]  62.74,46.38 0 top
U$9  [HOLD]  66.55,46.38 0 top
U$11  [HOLD]  78.52,40.79 0 top
U$12  [HOLD]  73.65,40.79 0 top
U$13  [HOLD]  39.37,34.5 0 top
U$14  [HOLD]  52.23,34.5 0 top
U$15  [HOLD]  44.2,11.51 0 top
U$20  [HOLD]  15.2,14 0 top
U$22  [HOLD]  73.2,14 0 top
VOL  10.7,72.5 180 bottom
VOLTAGE_ADJUST  39.24,60.98 270 top
Y1  78.61,55.27 0 top
~NUDEV~1  72.9,80.67 270 top

### Tracks (layer width: path | path; a pad name or v marks a point on that pad's centre or on a via)
1SD
  Top 0.203: 44.66,26.06 D2.A | K2.8 44.66,24.41 44.66,26.06 | Q1.3 52.86,39.31 ++2.MP 48.05,29.45 44.66,26.06
2
  Top 0.203: U$1.2B 17.83,7.13 17.83,10.62 22.71,15.49 42.62,15.49 43.44,16.31 43.44,17.32 41.72,19.04 K2.2
+5V  (via drill 0.3)
  Top 0.203: 58.1,60.16 61.52,56.74 62.13,56.74 U3.18 | SHIFT.P$1 46.89,70.36 52.78,70.36 53.8,69.34 POGO_PALACE.1 | 65.18,74.42 65.18,73.2 R18.2 | 65.18,74.42 65.18,75.44 C32.1 65.18,75.64 65.18,79.09 65.38,79.3 C33.+ 65.38,79.5 63.15,81.74 63.15,83.36 U6.2 | 65.18,74.42 60.91,74.42 D3.A 60.71,74.22 59.49,73 57.46,73 55.02,70.56 55.02,70.36 54,69.34 | 70.26,55.73 69.85,55.32 69.85,54.71 70.26,54.3 70.67,54.3 U3.4 | 70.26,55.73 70.67,55.73 U3.6 70.26,55.73 | 70.26,55.73 69.65,56.34 v69.65,56.95 | 65.18,74.42 68.84,74.42 69.45,73.81 69.45,71.37 70.67,70.15 DEPTH.P$1 | 54,69.34 POGO_PALACE.1 | 58.1,60.16 57.64,59.7 50.53,59.7 50.39,59.55 50.39,51.87 45.06,51.87 41.81,48.62 RATE.P$1 41.7,44.37 | 58.1,60.16 56.09,62.17 55.84,62.17 IC1.6 55.84,63.61 56.09,63.61 56.23,63.75 56.23,64.56 55.2,65.6 55.2,67.89 POGO_PALACE.1 | C23.+ 54,67.85 54,69.34 | 58.1,60.16 60.01,60.16 IC1.1 | 41.7,44.37 41.7,35.73 40.95,34.98 R38.2 40.22,30.34 D2.C 40.22,23.55 K2.1 | T1.3 56.44,35.64 56.44,39.69 51.76,44.37 41.7,44.37
  Bottom 0.203: v69.65,56.95 69.65,68.12 70.67,69.14 70.67,69.95 DEPTH.P$1
+18V
  Top 0.203: 18.44,49.23 18.44,44.75 17.02,43.33 16,43.33 U2.8 | 18.44,49.23 20.88,51.66 DIST_TRIM.3 | U1.7 8.77,61.42 13.16,57.02 13.16,50.39 14.33,49.23 18.44,49.23 | U6.1 62.94,88.04 60.51,88.04 60.3,88.24 D4.C 60.1,88.44 57.05,88.44 C35.1 56.85,88.24 52.99,88.24 51.77,87.02 | D3.C 58.47,76.86 C19.1 58.27,76.86 57.46,76.86 56.24,75.64 52.58,75.64 | 52.58,76.86 52.58,75.64 | 52.58,75.64 52.58,74.42 C18.1 | 52.58,76.86 52.58,79.3 C16.1 | 52.58,76.86 C17.1 | C16.1 52.58,79.5 52.58,82.55 R8.2 52.38,82.75 51.77,83.36 51.77,87.02 | 51.77,87.02 C34.+ | IC2.8 21.49,71.98 21.49,75.03 21.9,75.44 R1.1 22.1,75.64 22.1,78.69 C8.2 22.1,78.89 D1.C 23.12,81.94 24.95,83.77 29.21,83.77 C7.+ 29.41,83.77 33.48,79.7 33.48,79.5 37.34,79.5 37.43,79.41 | 37.43,79.41 C16.1 | 37.43,79.41 38.05,78.8 38.05,65.78 VOLTAGE_ADJUST.1
  Bottom 0.203: D1.C 19.59,81.94 13.46,75.82 13.46,66.6 8.89,62.03 8.89,61.62 U1.7
BTN_ONOFF
  Top 0.203: U3.1 70.87,51.66 74.93,47.6 74.93,45.57 74.32,44.96 72.49,44.96 71.48,43.94 66.6,43.94 ONOFF2.MP
BTN_WAVE
  Top 0.203: J3.5 75.87,32.04 R14.1
CIRCUIT_IN
  Top 0.203: C4.1 34.29,37.96 R4.1 35.71,29.23 35.71,20.51 37.89,18.34 40.03,18.34 K2.3
CIRCUIT_OUT
  Top 0.203: 46.89,14.48 K2.5 | 34.54,52.88 C1.- 36.54,50.85 36.54,21.18 37.96,19.76 48.52,19.76 48.72,19.56 48.72,18.54 47.7,17.53 45.06,17.53 44.86,17.32 44.86,16.28 46.5,14.64 K2.5 | K2.5 54.35,14.64 57.84,11.14 | 58.05,10.93 57.84,11.14 | 57.84,11.14 R13.1
CS
  Top 0.203: U3.14 65.08,58.66 65.08,58.19 64.94,58.04 63.37,58.04 61.88,59.53 61.88,61.15 61.56,61.47 60.35,61.47 IC1.2
DAC_OUT
  Top 0.203: IC1.8 55.07,60.4 40.76,60.4 VOLTAGE_ADJUST.3
FRMBUFF
  Top 0.203: R9.2 30.43,30.73 27.99,30.73 23.52,35.2 C6.-
  Bottom 0.203: U$1.3A 21.08,4.11 21.08,4.52 23.52,6.96 24.13,6.96 25.15,7.98 25.15,33.38 23.32,35.2 C6.-
GND1  (via drill 0.3)
  Top 0.203: R22.1 14.58,52.48 17.43,52.48 18.04,51.87 DIST_TRIM.1 18.24,51.87 19.66,53.29 21.49,53.29 21.9,52.88 21.9,50.65 20.88,49.63 20.88,47.19 U2.4 20.68,46.99 20.27,46.99 18.85,45.57 18.85,32.16 22.3,28.7 IN_JACK.TN 22.51,28.5 22.91,28.09 30.43,28.09 R9.1 | C18.2 55.42,74.22 58.27,74.22 C19.2 58.47,74.22 59.29,74.22 60.91,75.84 61.72,75.84 61.93,76.05 61.93,77.67 61.52,78.08 59.69,78.08 58.47,79.3 --.MP 58.27,79.5 55.42,79.5 C16.2 55.42,79.3 55.42,76.86 C17.2 | 55.02,61.62 IC1.7 51.58,61.62 C23.- 52.31,64.16 IC1.5 | D1.A 24.74,81.94 24.74,78.89 C8.1 24.95,78.69 25.35,78.28 28.4,78.28 R2.1 | C35.2 57.05,85.6 60.1,85.6 D4.A 60.3,85.8 70.26,85.8 | 30.59,27.99 R9.1 | 25.35,66.7 IC2.4 28.16,69.51 C11.- | 70.26,85.8 U6.3 | R4.2 33.4,27.85 | R4.2 34.21,27.93 | 70.26,84.58 70.26,85.8 | R4.2 33.48,27.89 30.63,27.89 R9.1 | 65.79,12.65 65.99,12.45 OUT_JACK.TN 64.91,11.14 R13.2 | 3.01,75 3.01,75.48 PAD2.1 3.05,75.03 v3.05,73.61 | 70.26,85.8 ~NUDEV~1.GND 76.56,81.94 83,75.5 PAD1.1
  other vias: 53.32,64.44
  pour Bottom (rank 2): -0.76,90.83 -0.76,-10.13 93.22,-10.13 93.22,90.83
GND2  (via drill 0.3)
  Top 0.203: 71.88,53.9 71.48,53.49 70.87,53.49 U3.3 | 71.88,53.9 71.88,54.51 71.48,54.91 70.87,54.91 U3.5 | C22.1 57.05,54.3 59.29,54.3 59.49,54.1 C14.1 59.69,54.1 62.13,54.1 U3.21 | C13.1 75.95,61.21 74.73,61.21 74.32,61.62 C20.1 | C12.1 81.23,61.21 82.65,61.21 C21.1 84.15,60.53 R12.2 | 69.09,75.44 70.26,75.44 70.67,75.03 DEPTH.P$3 | 69.09,75.44 68.02,75.44 C32.2 | v72.09,53.9 71.88,53.9 | ~NUDEV~1.GNDA 69.09,75.59 69.09,75.44 | ONOFF1.MP 62.74,43.77 62.74,43.74 62.74,41.91 R41.1
  pour Bottom: 65.28,29.87 88.08,29.87 88.08,72.68 81.7,72.68 75.81,80.67 62.74,80.67 62.74,74.32 60.2,72.42 39.88,72.42 39.88,67.97 50.04,67.97 50.04,65.43 56.39,65.43 57.02,64.8 57.02,57.17 50.04,57.17 50.04,52.73 37.34,52.73 37.34,21.61 37.98,20.98 48.27,20.98 49.54,19.71 59.56,19.71 60.84,20.98 60.84,25.42
IN
  Top 0.203: U$1.1A 14.58,4.11 16,4.11 17.63,5.74 19.66,5.74 20.88,6.96 U$1.3B 21.08,7.16 21.08,11.02 22.3,12.24 IN_JACK.T 22.51,12.45 24.54,14.48 41.4,14.48 K2.4
INDICATOR1
  Top 0.203: R38.1 43.75,34.3 LONGLEGS.MP
MISO  (via drill 0.3)
  Top 0.203: U3.16 63.75,59.97 v63.38,60.35
  Bottom 0.203: v63.38,60.35 63.38,64.16 60.84,66.7 58.3,66.7 56.44,68.55 56.44,69.14 POGO_PALACE.2
MOSFET  (via drill 0.3)
  Top 0.203: v66.6,52.27 66.8,52.48 66.8,58.78 U3.12 | v63.96,47.4 63.49,47.4 63.26,47.63 60.82,47.63 R45.2
  Bottom 0.203: v63.96,47.4 66.8,50.24 66.8,51.87 66.6,52.07 v66.6,52.27
MOSI
  Top 0.203: 59.69,64.06 60.1,64.06 IC1.4 | 59.69,64.06 59.08,64.67 59.08,69.14 POGO_PALACE.3 | 59.69,64.06 IC1.4 | IC1.4 60.92,63.44 61.16,63.44 64.55,60.06 U3.15
N$1
  Top 0.203: 23.93,48.41 24.34,48.82 24.34,49.43 R3.1 | 23.93,48.41 21.29,45.77 20.88,45.77 U2.3 | 23.93,48.41 25.55,46.79 25.55,45.97 24.74,45.16 24.74,42.72 C4.2
N$2
  Top 0.203: 25.35,75.44 24.95,75.44 R1.2 25.35,75.44 | 25.35,75.44 28.4,75.44 R2.2 28.6,75.64 29.82,76.86 C2.+ | 25.35,75.44 25.35,71.98 IC2.5
N$3
  Top 0.203: R12.1 78.65,51.05 ONOFF3.MP
N$4
  Top 0.203: VOLTAGE_ADJUST.2 35.42,62.61 35.42,64.31 R16.1
N$5
  Top 0.203: 9.35,52.68 10.52,52.68 C3.2 | U2.7 15.85,44.55 12.35,44.55 10.72,46.18 R5.1 10.52,46.38 10.52,46.99 9.3,48.21 9.3,52.68 9.35,52.68 | 9.35,52.68 9.35,55.93 5.28,59.99 5.28,62.64 8.94,66.29 14.02,66.29 17.68,69.95 VOL.P$3
N$6
  Top 0.203: 20.88,44.15 20.88,44.35 U2.2 | 20.88,44.15 20.88,43.33 U2.1 20.88,43.13 23.32,40.69 23.32,37.24 C6.+ 28.1,37.22 R19.1 | C5.2 23.12,46.38 20.88,44.15
N$7
  Top 0.203: R6.2 28.6,52.21 28.6,47.4 29.62,46.38 C5.1
N$8
  Top 0.203: R6.1 29.09,56.54 U1.1
N$9
  Bottom 0.203: C1.+ 34.34,55.12 34.34,56.54 18.49,72.39 17.88,72.39 VOL.P$2
N$10
  Top 0.203: J2.1 36.73,10.62 36.73,12.85 J2.2
N$11
  Top 0.203: U1.4 16.82,61.62 22.91,55.52 24.54,55.52 R7.1
N$12
  Top 0.203: R7.2 24.54,52.68 23.12,52.68 19.66,56.13 DIST_TRIM.2
N$13
  Top 0.203: U3.8 70.87,57.56 72.7,57.56 74.12,58.98 C20.2 74.32,59.18 74.53,59.39 75.95,59.39 C13.2 76.15,59.39 76.15,55.32 Y1.1
N$14
  Top 0.203: 30.63,65.89 30.63,63.04 R10.2 30.63,62.84 31.45,62.03 31.45,59.18 R11.1 | 30.63,65.89 C9.2 | 30.63,65.89 29.3,67.22 26.78,67.22 25.83,66.27 25.83,65.41 25.68,65.27 23.59,65.27 23.45,65.41 23.45,65.91 IC2.2
N$15
  Top 0.203: 81.23,59.39 82.86,59.39 83.06,59.18 C21.2 | 81.23,59.39 81.23,55.32 Y1.2 81.16,54.13 82.96,52.32 82.96,49.77 81.16,47.97 81.16,45.49 81.03,45.36 75.54,45.36 75.34,45.57 75.34,52.68 71.48,56.54 70.94,56.54 U3.7 | 81.23,59.39 C12.2
N$16
  Top 0.203: C22.2 57.05,56.13 59.08,56.13 59.49,56.54 C14.2 59.69,56.54 61.11,55.12 62.13,55.12 U3.20
N$17
  Top 0.203: J3.4 76.71,36.65 R23.1
N$18
  Top 0.203: 79.81,43.53 R24.1 79.89,36.02 J3.3
N$19
  Top 0.203: R25.1 83.06,35.38 J3.2
N$20
  Top 0.203: J10.1 51.77,10.62 51.77,12.85 J10.2
N$21
  Top 0.203: R22.2 14.38,55.52 14.38,61.21 13.97,61.62 U1.5
N$22
  Top 0.203: R26.1 73.75,43.93 74.72,43.93 75.75,44.96 84.08,44.96 84.89,44.15 84.89,36.09 J3.1
N$23
  Top 0.203: U3.30 67.82,50.24 67.82,48.62 69.85,46.58 73.51,46.58 R26.2
N$24  (via drill 0.3)
  Top 0.203: v68.63,49.23 68.63,50.24 U3.31 | v81.84,47.8 83.06,46.58 R25.2
  Bottom 0.203: v68.63,49.23 70.67,49.23 71.85,48.05 80.9,48.05 81.77,47.8 v81.84,47.8
N$25
  Top 0.203: 79.82,46.57 R24.2 79.89,47.27 82.56,49.94 82.56,52.15 79.8,54.9 79.8,59.59 76.15,63.25 72.29,63.25 68.63,59.59 68.63,59.01 U3.10
N$26
  Top 0.203: U3.11 67.82,58.78 67.82,58.37 68.23,57.96 69.85,57.96 72.9,61.01 72.9,62.03 73.71,62.84 75.95,62.84 77.17,61.62 77.17,46.97 R23.2
N$27
  Top 0.203: RATE.P$2 45.54,49.84 57.31,49.84 59.56,52.09 61.08,52.09 61.62,52.63 U3.23
N$28  (via drill 0.3)
  Top 0.203: v65.03,57.12 65.03,53.95 62.94,51.87 62.33,51.87 U3.24
  Bottom 0.203: v65.03,57.12 65.03,61.06 69.04,65.07 69.04,71.58 69.85,72.39 70.67,72.39 DEPTH.P$2
N$29  (via drill 0.3)
  Top 0.203: SHIFT.P$2 46.09,68.61 v50.67,68.61 | v63.12,50.34 U3.25
  Bottom 0.203: v50.67,68.61 53.22,66.06 57.02,66.06 62.1,60.98 62.1,59.08 63.38,57.81 63.38,50.6 v63.12,50.34
N$30  (via drill 0.3)
  Top 0.203: v70.06,47.19 69.45,47.8 69.45,50.24 U3.32 | v70.06,43.33 70.06,35.05 R14.2
  Bottom 0.203: v70.06,43.33 v70.06,47.19
N$39
  Top 0.203: C15.+ 67.5,34.14 R15.2 68.32,37.63 R46.1
N$40
  Top 0.203: T1.2 60.55,32.16 R15.1
N$41
  Top 0.203: R8.1 55.42,82.55 58.27,82.55 ++.MP
N$42
  Top 0.203: C9.1 27.79,65.89 27.79,63.04 R10.1 27.59,63.04 21.49,63.04 | 21.49,63.04 21.49,61.62 U1.2 | 21.49,63.04 21.49,66.5 IC2.1
N$43
  Top 0.203: R17.2 56.68,30.73 T1.1
N$44
  Top 0.203: OK1.1 58.08,25.44 R17.1
N$59
  Top 0.203: K2.7 46.69,18.95 45.14,18.95 44.21,18.02 44.21,14.85 38.56,9.19 25.76,9.19 21.9,5.33 19.05,5.33 17.83,4.11 U$1.2A
N$84
  Top 0.203: R45.1 56.19,41.81 Q1.2 60.64,41.21 R41.2
OUT
  Top 0.203: OUT_JACK.T 66.15,22.35 62.62,18.82 56.98,18.82 55.29,17.13 OK1.3 54.55,16.84 K2.6
PHOTO_TRANS  (via drill 0.3)
  Top 0.203: v65.79,51.87 65.79,55.12 65.99,55.32 65.99,58.78 U3.13 | v64.57,48.82 64.57,43.74 67.84,40.47 R46.2
  Bottom 0.203: v64.57,48.82 64.57,50.44 65.79,51.66 v65.79,51.87
R
  Top 0.203: R11.2 34.29,59.18 34.29,62.64 R16.2 34.09,62.84 32.87,64.06 32.87,66.5 33.07,66.7 33.28,66.7 35.92,69.34 C10.+
RESET  (via drill 0.3)
  Top 0.203: v67.41,57.56 67.41,52.27 67.01,51.87 67.01,50.44 U3.29 | v67.41,60.2 67.41,68.33 66.6,69.14 POGO_PALACE.6 66.6,69.34 67.82,70.56 67.82,73 R18.1
  Bottom 0.203: v67.41,60.2 v67.41,57.56
SCK
  Top 0.203: U3.17 61.47,58.22 61.47,60.98 61.39,61.07 59.23,61.07 59.09,61.22 59.09,62.03 | 59.09,62.03 59.23,62.17 59.48,62.17 IC1.3 | 59.09,62.03 59.09,64.09 57.74,65.44 57.74,70.67 58.44,71.37 59.42,71.37 60.12,70.67 60.12,70.59 POGO_PALACE.4
TAPTEMPO
  Top 0.203: U3.2 71.94,52.63 ONOFF4.MP
VB
  Top 0.203: 23.93,65.89 23.93,66.5 IC2.3 24,67.12 23.14,67.98 22.72,67.98 22.1,68.61 | 22.1,70.36 22.1,71.17 22.71,71.78 IC2.7 22.91,71.98 23.93,71.98 IC2.6 24.13,71.78 24.13,71.17 24.95,70.36 25.55,70.36 26.57,71.37 29.62,71.37 C11.+ | 22.1,68.61 22.1,68.12 21.08,68.12 19.05,66.09 19.05,61.62 | 27.18,49.63 27.18,49.79 27.18,55.12 22.3,59.99 20.68,59.99 19.05,61.62 | 27.18,49.63 R3.2 | 19.05,61.62 U1.3 | U2.5 12.35,50.49 12.35,55.78 7.85,60.28 7.85,62.66 8.39,63.19 9.14,63.19 10.72,61.62 U1.6 | 22.1,70.36 21.13,70.36 20.73,70.76 20.73,71.98 17.88,74.83 VOL.P$1 | 22.1,70.36 22.1,68.61 | R19.2 27.18,40.94 27.18,49.63
  Bottom 0.203: C10.- 35.92,71.58 35.1,72.39 31.45,72.39 30.43,71.37 29.82,71.37 C11.+ | U1.3 17.02,59.72 13.23,59.72 11.33,61.62 U1.6
VCA_OUT
  Top 0.203: 11.33,49.83 10.72,49.23 R5.2 11.33,49.83 | 11.33,49.83 11.94,50.44 11.94,53.49 10.72,54.71 10.72,55.32 C3.1 10.52,55.52 6.25,59.79 6.25,61.62 U1.8 | 11.33,49.83 15.39,45.77 15.8,45.77 U2.6

### Text on the board
tPlace: GOLDTOOTH TRM V3.6 | BUILT BY: | DATE: